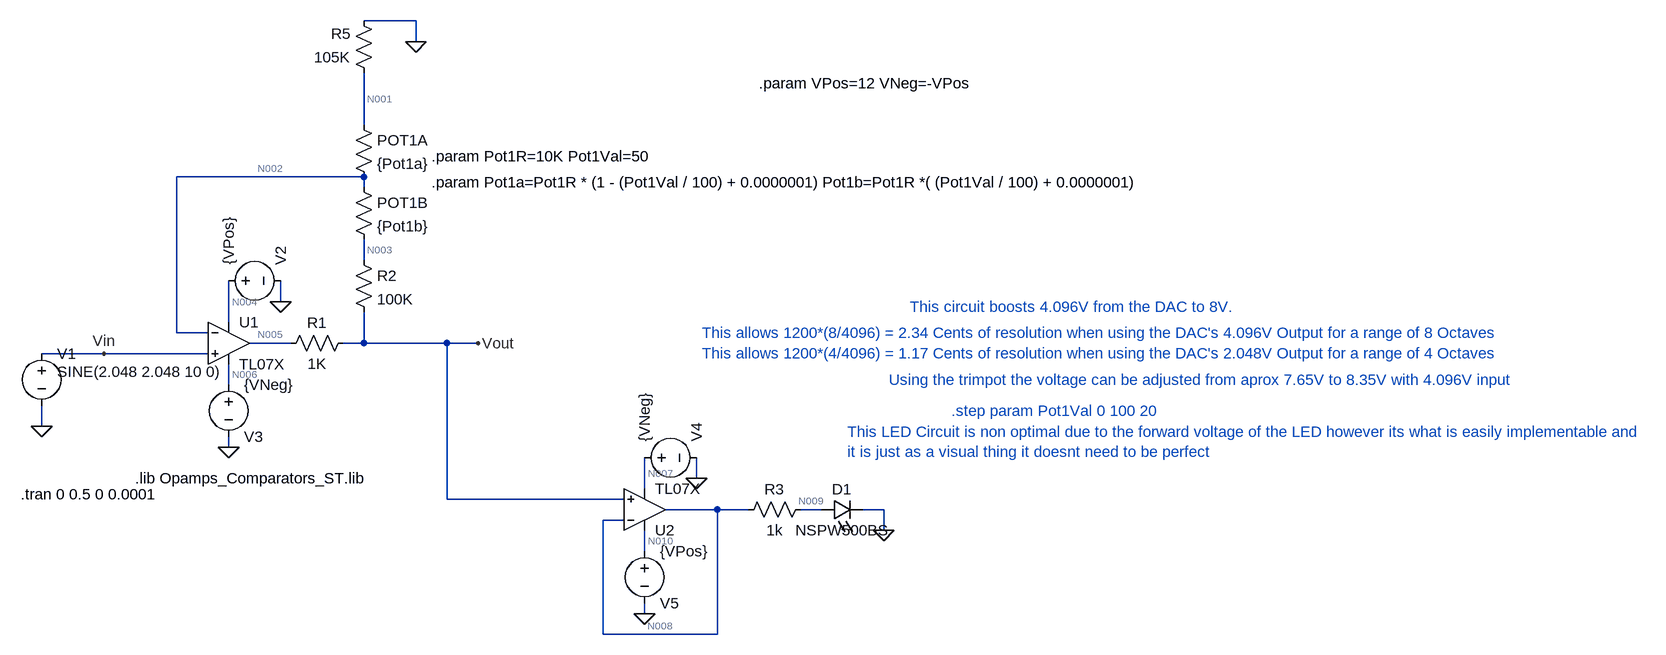
[diagram p0: schematic Voct Outputs.asc]
Voct Outputs.asc, the LTspice schematic file:
Version 4
SHEET 1 2432 680
WIRE 432 -352 352 -352
WIRE 432 -320 432 -352
WIRE 352 -192 352 -272
WIRE 352 -112 64 -112
WIRE 352 -96 352 -112
WIRE 352 16 352 -16
WIRE 224 80 224 48
WIRE 144 112 144 48
WIRE 64 128 64 -112
WIRE 112 128 64 128
WIRE 240 144 176 144
WIRE 352 144 352 96
WIRE 352 144 320 144
WIRE 480 144 352 144
WIRE 528 144 480 144
WIRE -48 160 -144 160
WIRE 112 160 -48 160
WIRE 144 208 144 176
WIRE -144 272 -144 240
WIRE 144 304 144 288
WIRE 864 352 864 320
WIRE 784 368 784 320
WIRE 480 384 480 144
WIRE 752 384 480 384
WIRE 896 400 816 400
WIRE 944 400 896 400
WIRE 1056 400 1024 400
WIRE 1152 400 1120 400
WIRE 752 416 720 416
WIRE 1152 432 1152 400
WIRE 784 464 784 432
WIRE 784 560 784 544
WIRE 720 592 720 416
WIRE 896 592 896 400
WIRE 896 592 720 592
FLAG 144 304 0
FLAG -144 272 0
FLAG 224 80 0
FLAG 432 -320 0
FLAG -48 160 Vin
FLAG 528 144 Vout
FLAG 864 352 0
FLAG 784 560 0
FLAG 1152 432 0
SYMBOL Opamps\\opamp2 144 80 R0
SYMATTR InstName U1
SYMATTR Value TL07X
SYMBOL voltage -144 144 R0
WINDOW 3 24 44 Left 2
WINDOW 123 0 0 Left 0
WINDOW 39 0 0 Left 0
SYMATTR Value SINE(2.048 2.048 10 0)
SYMATTR InstName V1
SYMBOL voltage 128 48 R270
WINDOW 0 24 96 Left 2
WINDOW 3 24 16 Left 2
WINDOW 123 0 0 Left 0
WINDOW 39 0 0 Left 0
SYMATTR InstName V2
SYMATTR Value {VPos}
SYMBOL voltage 144 192 R0
WINDOW 0 24 96 Left 2
WINDOW 3 24 16 Left 2
WINDOW 123 0 0 Left 0
WINDOW 39 0 0 Left 0
SYMATTR InstName V3
SYMATTR Value {VNeg}
SYMBOL res 336 128 R90
WINDOW 0 0 56 VBottom 2
WINDOW 3 32 56 VTop 2
SYMATTR InstName R1
SYMATTR Value 1K
SYMBOL res 336 0 R0
SYMATTR InstName R2
SYMATTR Value 100K
SYMBOL res 368 -256 R180
WINDOW 0 36 76 Left 2
WINDOW 3 36 40 Left 2
SYMATTR InstName R5
SYMATTR Value 105K
SYMBOL res 336 -112 R0
SYMATTR InstName POT1B
SYMATTR Value {Pot1b}
SYMBOL res 336 -208 R0
SYMATTR InstName POT1A
SYMATTR Value {Pot1a}
SYMBOL Opamps\\opamp2 784 464 M180
SYMATTR InstName U2
SYMATTR Value TL07X
SYMBOL voltage 768 320 R270
WINDOW 0 24 96 Left 2
WINDOW 3 24 16 Left 2
WINDOW 123 0 0 Left 0
WINDOW 39 0 0 Left 0
SYMATTR InstName V4
SYMATTR Value {VNeg}
SYMBOL voltage 784 448 R0
WINDOW 0 24 96 Left 2
WINDOW 3 24 16 Left 2
WINDOW 123 0 0 Left 0
WINDOW 39 0 0 Left 0
SYMATTR InstName V5
SYMATTR Value {VPos}
SYMBOL LED 1056 416 R270
WINDOW 0 32 32 VTop 2
WINDOW 3 0 32 VBottom 2
SYMATTR InstName D1
SYMATTR Value NSPW500BS
SYMATTR Description Diode
SYMATTR Type diode
SYMBOL res 1040 384 R90
WINDOW 0 0 56 VBottom 2
WINDOW 3 32 56 VTop 2
SYMATTR InstName R3
SYMATTR Value 1k
TEXT 0 352 Left 2 !.lib Opamps_Comparators_ST.lib
TEXT 456 -144 Left 2 !.param Pot1R=10K Pot1Val=50
TEXT 456 -104 Left 2 !.param Pot1a=Pot1R * (1 - (Pot1Val / 100) + 0.0000001) Pot1b=Pot1R *( (Pot1Val / 100) + 0.0000001)
TEXT -176 376 Left 2 !.tran 0 0.5 0 0.0001
TEXT 960 -256 Left 2 !.param VPos=12 VNeg=-VPos
TEXT 1256 248 Left 2 ;.step param Pot1Val 0 100 20
TEXT 1192 88 Left 2 ;This circuit boosts 4.096V from the DAC to 8V.
TEXT 872 128 Left 2 ;This allows 1200*(8/4096) = 2.34 Cents of resolution when using the DAC's 4.096V Output for a range of 8 Octaves\nThis allows 1200*(4/4096) = 1.17 Cents of resolution when using the DAC's 2.048V Output for a range of 4 Octaves
TEXT 1160 200 Left 2 ;Using the trimpot the voltage can be adjusted from aprox 7.65V to 8.35V with 4.096V input
TEXT 1096 280 Left 2 ;This LED Circuit is non optimal due to the forward voltage of the LED however its what is easily implementable and\nit is just as a visual thing it doesnt need to be perfect

The netlist it stands for:
* Voct Outputs.asc
XU1 Vin N002 N004 N006 N005 TL07X  ; pins In+ In- V+ V- OUT
V1 Vin 0 SINE(2.048 2.048 10 0)
V2 N004 0 {VPos}
V3 N006 0 {VNeg}
R1 Vout N005 1K
R2 N003 Vout 100K
R5 N001 0 105K
R§POT1B N002 N003 {Pot1b}
R§POT1A N001 N002 {Pot1a}
XU2 Vout N008 N010 N007 N008 TL07X  ; pins In+ In- V+ V- OUT
V4 N007 0 {VNeg}
V5 N010 0 {VPos}
D1 N009 0 NSPW500BS
R3 N009 N008 1k
.model D D
.lib standard.dio
.lib Opamps_Comparators_ST.lib
.param Pot1R=10K Pot1Val=50
.param Pot1a=Pot1R * (1 - (Pot1Val / 100) + 0.0000001) Pot1b=Pot1R *( (Pot1Val / 100) + 0.0000001)
.tran 0 0.5 0 0.0001
.param VPos=12 VNeg=-VPos
* .step param Pot1Val 0 100 20
* This circuit boosts 4.096V from the DAC to 8V.
* This allows 1200*(8/4096) = 2.34 Cents of resolution when using the DAC's 4.096V Output for a range of 8 Octaves
* This allows 1200*(4/4096) = 1.17 Cents of resolution when using the DAC's 2.048V Output for a range of 4 Octaves
* Using the trimpot the voltage can be adjusted from aprox 7.65V to 8.35V with 4.096V input
* This LED Circuit is non optimal due to the forward voltage of the LED however its what is easily implementable and
* it is just as a visual thing it doesnt need to be perfect
.backanno
.end

* Results of the author's LTspice run, read from the files saved beside the schematic
* Operating Point, zero values left out:
*   V(vin) = 2.048 V
*   V(n006) = -12 V
*   V(n002) = 2.048 V
*   V(n004) = 12 V
*   V(n005) = 4.021 V
*   V(vout) = 4.003 V
*   V(n003) = 2.141 V
*   V(n001) = 1.955 V
*   V(n007) = -12 V
*   V(n008) = 4.003 V
*   V(n010) = 12 V
*   V(n009) = 2.709 V
*   I(D1) = 1.294 mA
*   I(R3) = -1.294 mA
*   I(Pot1a) = -18.62 µA
*   I(Pot1b) = -18.62 µA
*   I(R5) = 18.62 µA
*   I(R2) = -18.62 µA
*   I(R1) = -18.62 µA
*   I(V5) = -1.409 mA
*   I(V4) = 115.4 µA
*   I(V3) = 1.391 mA
*   I(V2) = -1.409 mA
*   Ix(u1:4) = 1.409 mA
*   Ix(u1:5) = -1.391 mA
*   Ix(u1:3) = -18.62 µA
*   Ix(u2:4) = 1.409 mA
*   Ix(u2:5) = -115.4 µA
*   Ix(u2:3) = -1.294 mA
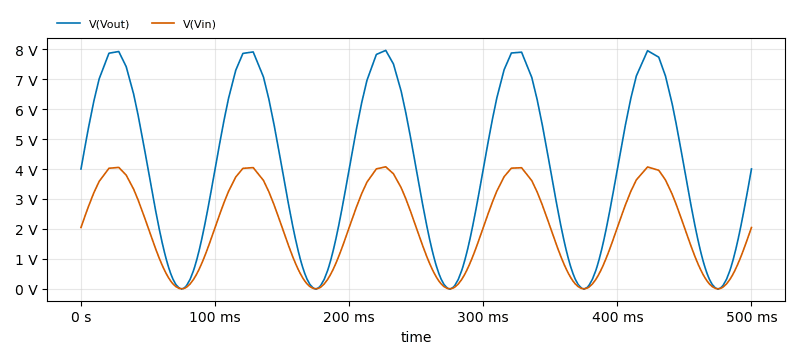
[diagram p1: Transient Analysis of Voct Outputs.asc, plotted from the saved traces]
* Transient Analysis, 1 run:
*   V(Vout): min 52.1 µV, max 7.965 V, average 3.988 V, rms 4.882 V, last 4.003 V
*   V(Vin): min 26.65 µV, max 4.075 V, average 2.04 V, rms 2.498 V, last 2.048 V